# Altium schematic sheet WiFi.SchDoc
size 420 x 297 mm; Address1: Address1; Address2: Address2; Address3: Address3; Address4: Address4; DocumentNumber: АБВГ.123456.001 Э3; SheetNumber: 3; SheetTotal: 5; Scale: 1:1; DocumentType: Схема электрическая принципиальная; FirstReferrence: АБВГ.123456.001
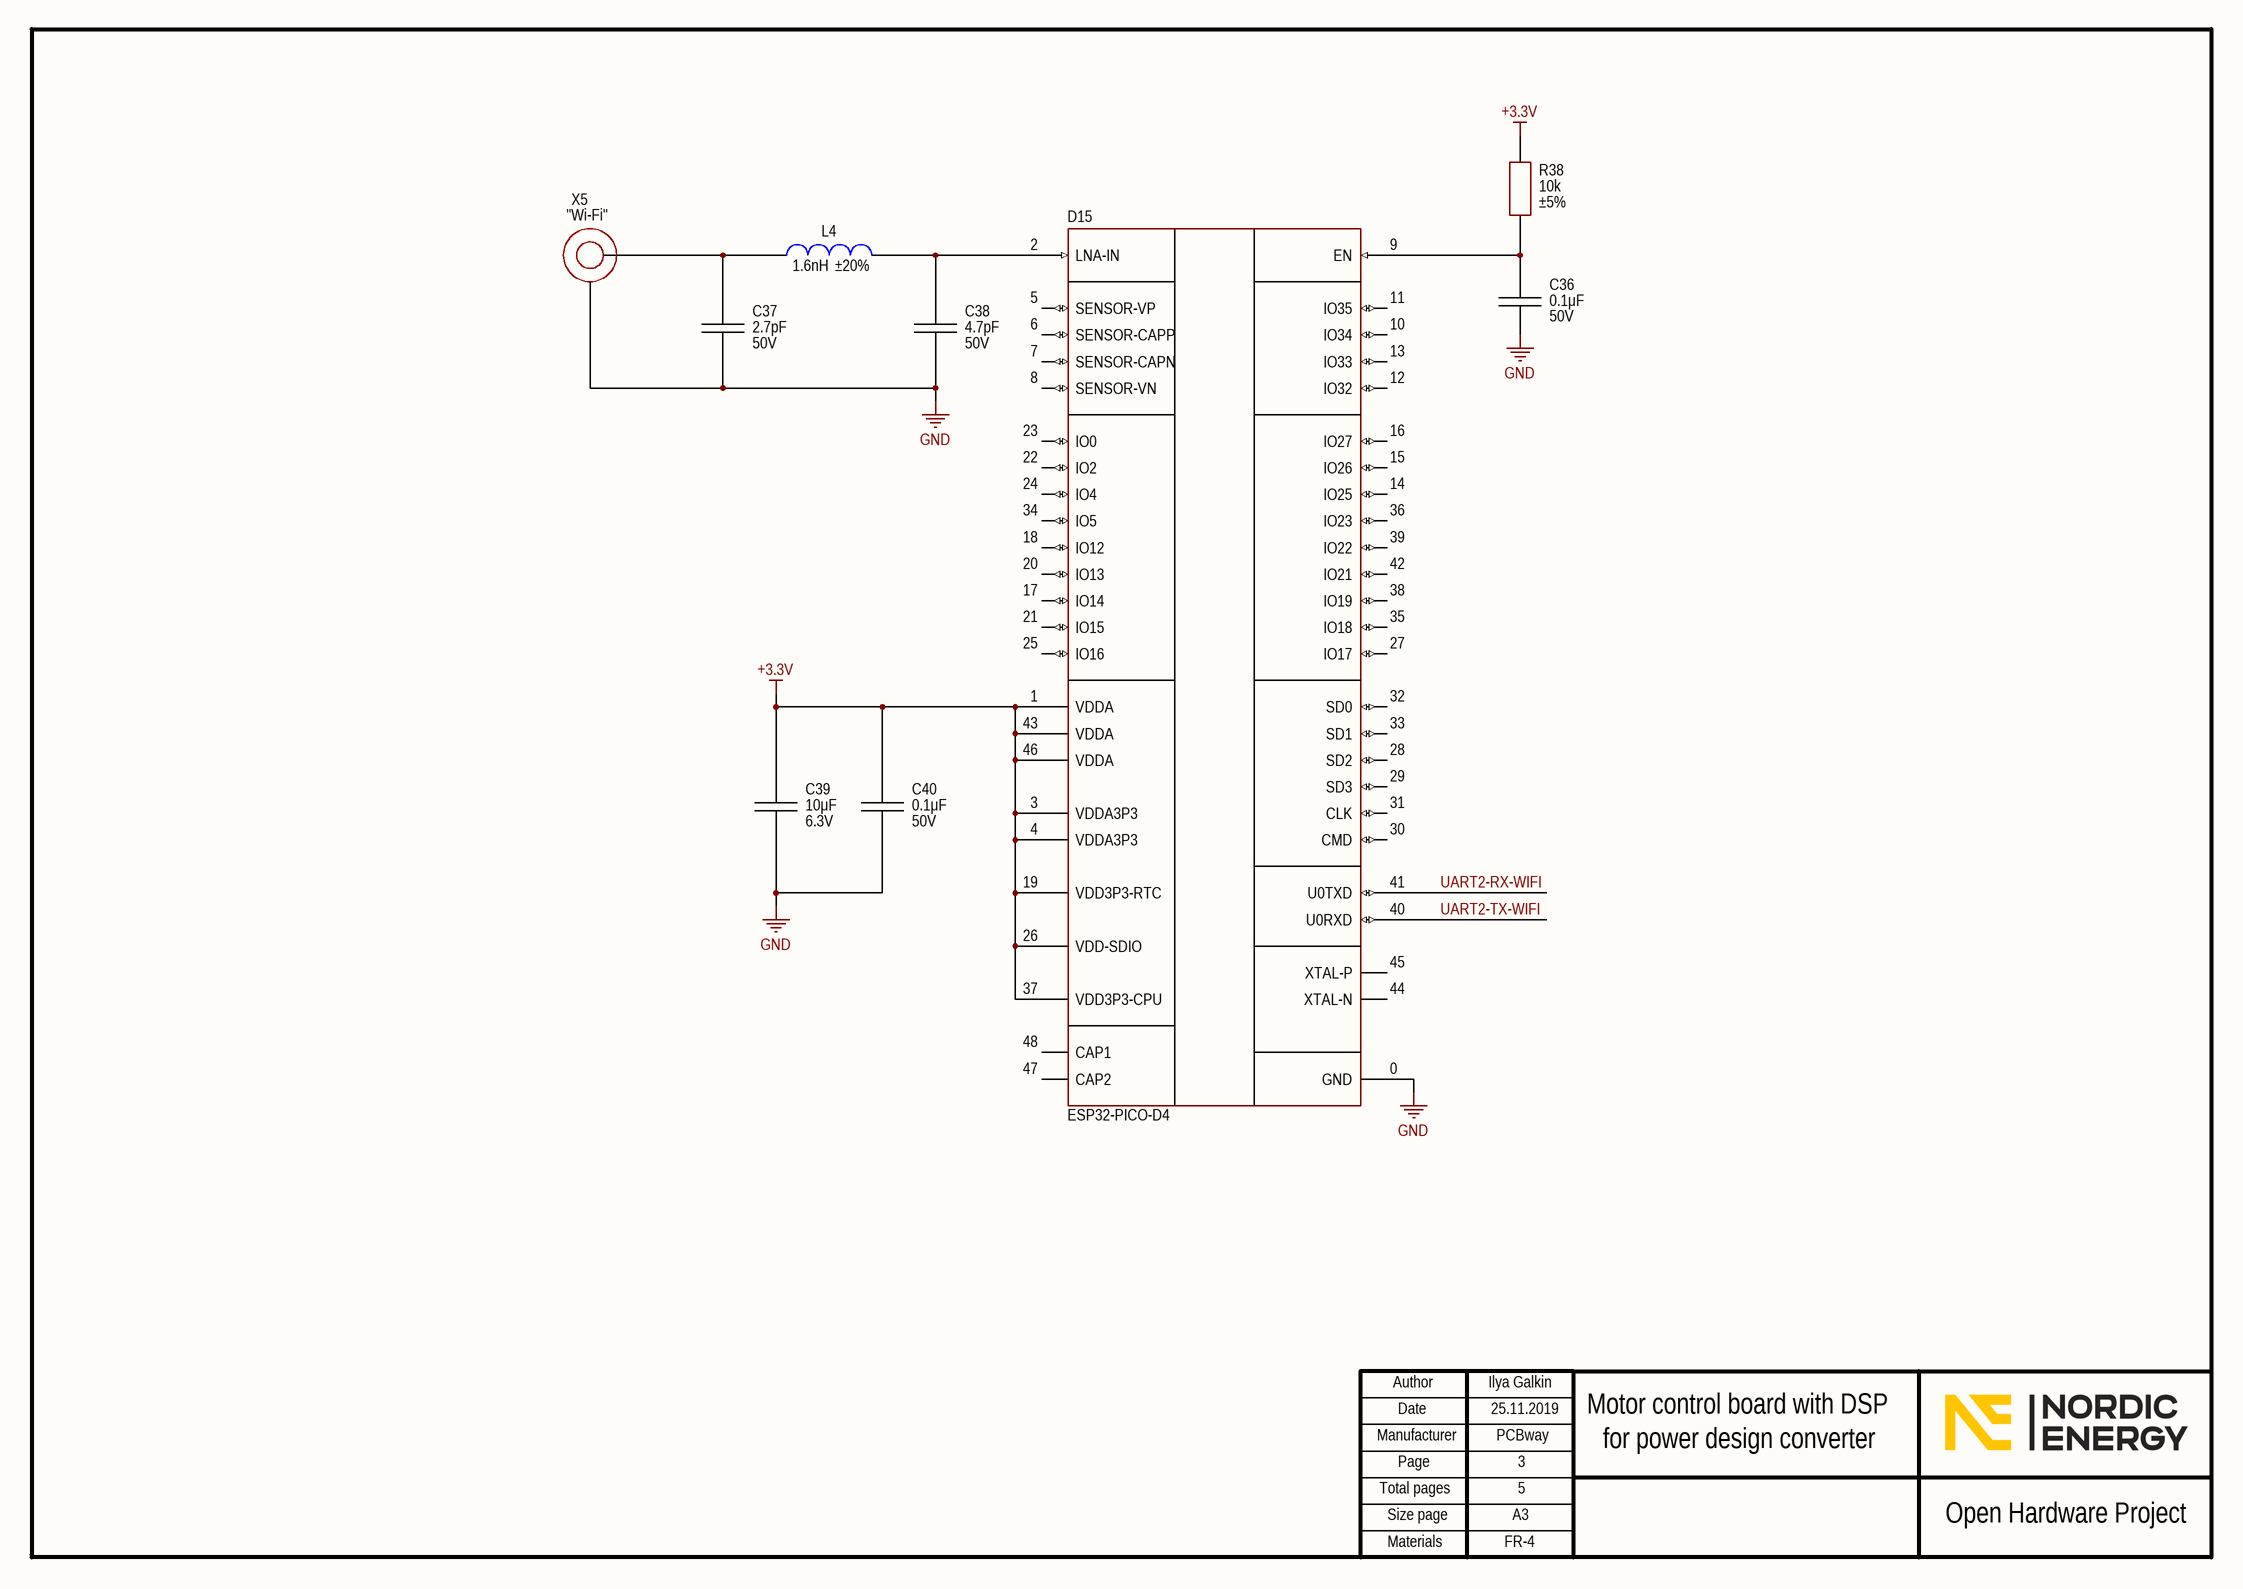
[diagram p0: WiFi.SchDoc]

## Parts
C36  value 0.1μF  Voltage: 50V  [CAP: 0603]
C37  value 2.7pF  Voltage: 50V  [CAP: 0603]
C38  value 4.7pF  Voltage: 50V  [CAP: 0603]
C39  value 10μF  Voltage: 6.3V  [CAP: 0603]
C40  value 0.1μF  Voltage: 50V  [CAP: 0603]
D15  (no value)  [48-LGA (7x7)]
L4  value 1.6nH  Tolerance: ±20%  [IND: 0603]
R38  value 10k  Tolerance: ±5%  [RES: 0603]
X5  CommentText: "Wi-Fi"  [CON: u.Fl]

## Nets
+3.3V: C39.2 C40.2 D15.1(VDDA) D15.3(VDDA3P3) D15.4(VDDA3P3) D15.19(VDD3P3-RTC) D15.26(VDD-SDIO) D15.37(VDD3P3-CPU) D15.43(VDDA) D15.46(VDDA) R38.2
GND: C36.1 C37.1 C38.1 C39.1 C40.1 D15.0(GND) X5.2
UART2-RX-WIFI: D15.41(U0TXD)
UART2-TX-WIFI: D15.40(U0RXD)
NetC36_2: C36.2 D15.9(EN) R38.1
NetC37_2: C37.2 L4.2 X5.1
NetC38_2: C38.2 D15.2(LNA-IN) L4.1

Not connected (* = marked no-connect by the designer): D15 5(SENSOR-VP) 6(SENSOR-CAPP) 7(SENSOR-CAPN) 8(SENSOR-VN) 10(IO34) 11(IO35) 12(IO32) 13(IO33) 14(IO25) 15(IO26) 16(IO27) 17(IO14) 18(IO12) 20(IO13) 21(IO15) 22(IO2) 23(IO0) 24(IO4) 25(IO16) 27(IO17) 28(SD2) 29(SD3) 30(CMD) 31(CLK) 32(SD0) 33(SD1) 34(IO5) 35(IO18) 36(IO23) 38(IO19) 39(IO22) 42(IO21) 44(XTAL-N) 45(XTAL-P) 47(CAP2) 48(CAP1)

## Notes on the sheet
- Ilya Galkin
- 25.11.2019
- PCBway
- 3
- Motor control board with DSP
- for power design converter
- 5
- FR-4
- Author
- Manufacturer
- Date
- Page
- Total pages
- Size page
- A3
- Open Hardware Project
- Materials

## Library data of the parts
C36 C40 = Ceramic_0603: Manufacturer: Samsung; PartNumber: CL10B104KB8NNNC; ValueManufacturerPartNumber: Ceramic capacitor, 0.1μF, X7R, ±10%, 50V, 0603, -55...+125°C; TypeCapacitor: Ceramic capacitor; Tolerance: ±10%; TypeDielectric: X7R; Package: 0603; HelpURL: https://www.digikey.com/product-detail/en/samsung-electro-mechanics/CL10B104KB8NNNC/1276-1000-1-ND/3889086; Temperature: -55...+125°C
C37 = Ceramic_0603: Manufacturer: Samsung; PartNumber: CL10C2R7BB8NNNC; ValueManufacturerPartNumber: Ceramic capacitor, 2.7pF, NPO, ±10%, 50V, 0603, -55...+125°C; TypeCapacitor: Ceramic capacitor; Tolerance: ±10%; TypeDielectric: NPO; Package: 0603; HelpURL: https://www.digikey.com/product-detail/en/samsung-electro-mechanics/CL10C2R7BB8NNNC/1276-1240-1-ND/3889326; Temperature: -55...+125°C
C38 = Ceramic_0603: Manufacturer: Samsung; PartNumber: CL10C4R7CB8NNNC; ValueManufacturerPartNumber: Ceramic capacitor, 4.7pF, NPO, ±10%, 50V, 0603, -55...+125°C; TypeCapacitor: Ceramic capacitor; Tolerance: ±10%; TypeDielectric: NPO; Package: 0603; HelpURL: https://www.digikey.com/product-detail/en/samsung-electro-mechanics/CL10C4R7CB8NNNC/1276-1282-1-ND/3889368; Temperature: -55...+125°C
C39 = Ceramic_0603: Manufacturer: Samsung; PartNumber: CL10B106MQ8NRNC; ValueManufacturerPartNumber: Ceramic capacitor, 10μF, X7R, ±10%, 6.3V, 0603, -55...+125°C; TypeCapacitor: Ceramic capacitor; Tolerance: ±10%; TypeDielectric: X7R; Package: 0603; HelpURL: https://www.digikey.com/product-detail/en/samsung-electro-mechanics/CL10B106MQ8NRNC/1276-1948-1-ND/3890034; Temperature: -55...+125°C
D15 = ESP32-PICO-D4: Wi-Fi+BT; Manufacturer: Espressif Systems; ValueManufacturerPartNumber: IC RF transceiver, 802.11b/g/n + Bluetooth v4.2, 2.4GHz, 32-Bit, Xtensa LX6, 4Mb, 520KB, 2.7...3.6V, -40...+85°C, 48-LGA; Supply: 2.7...3.6V; CoreSpeed: 600 DMIPS; CoreSize: 32-Bit; MemoryROM: 4Mb; MemoryRAM: 520KB; CoreProcessor: Xtensa LX6; Frequency: 2.4GHz; TypeProtocol: 802.11b/g/n + Bluetooth v4.2; HelpURL: https://www.digikey.com/product-detail/en/espressif-systems/ESP32-PICO-D4/1904-1029-1-ND/9381738; Package: 48-LGA; ComponentType: IC RF transceiver; Temperature: -40...+85°C; PartNumber: ESP32-PICO-D4
L4 = Inductor_0603: Manufacturer: Bourns; PartNumber: CW161009A-1N6D; ValueManufacturerPartNumber: Fixed inductor, 1.6nH, ±20%, 0603, 700mA, -40...+125°C; TypeInductor: Fixed inductor; MaxCurrent: 700mA; Package: 0603; HelpURL: https://www.digikey.com/product-detail/en/bourns-inc/CW161009A-1N6D/CW161009A-1N6DCT-ND/9826842; Temperature: -40...+125°C
R38 = Resistor_0603: Manufacturer: Yageo; PartNumber: RC0603JR-0710KL; ValueManufacturerPartNumber: Resistor film, 10k, ±5%, 0603, 0.1W, -55...+125°C; TypeResistor: Resistor film; Power: 0.1W; Package: 0603; HelpURL: https://www.digikey.com/product-detail/en/yageo/RC0603JR-0710KL/311-10KGRCT-ND/729647; Temperature: -55...+125°C
X5 = Connector_uFL: Manufacturer: Hirose Electric; ValueManufacturerPartNumber: Connector u.FL, 50 Ohm, 6GHz; PartNumber: U.FL-R-SMT(01); TypeConnector: Connector u.FL; Frequency: 6GHz; Impedance: 50 Ohm; HelpURL: https://www.digikey.com/product-detail/en/hirose-electric-co-ltd/U.FL-R-SMT-01/H9161-ND/513010